# Altium project TC364_MainBoard_V1.2.PrjPcb
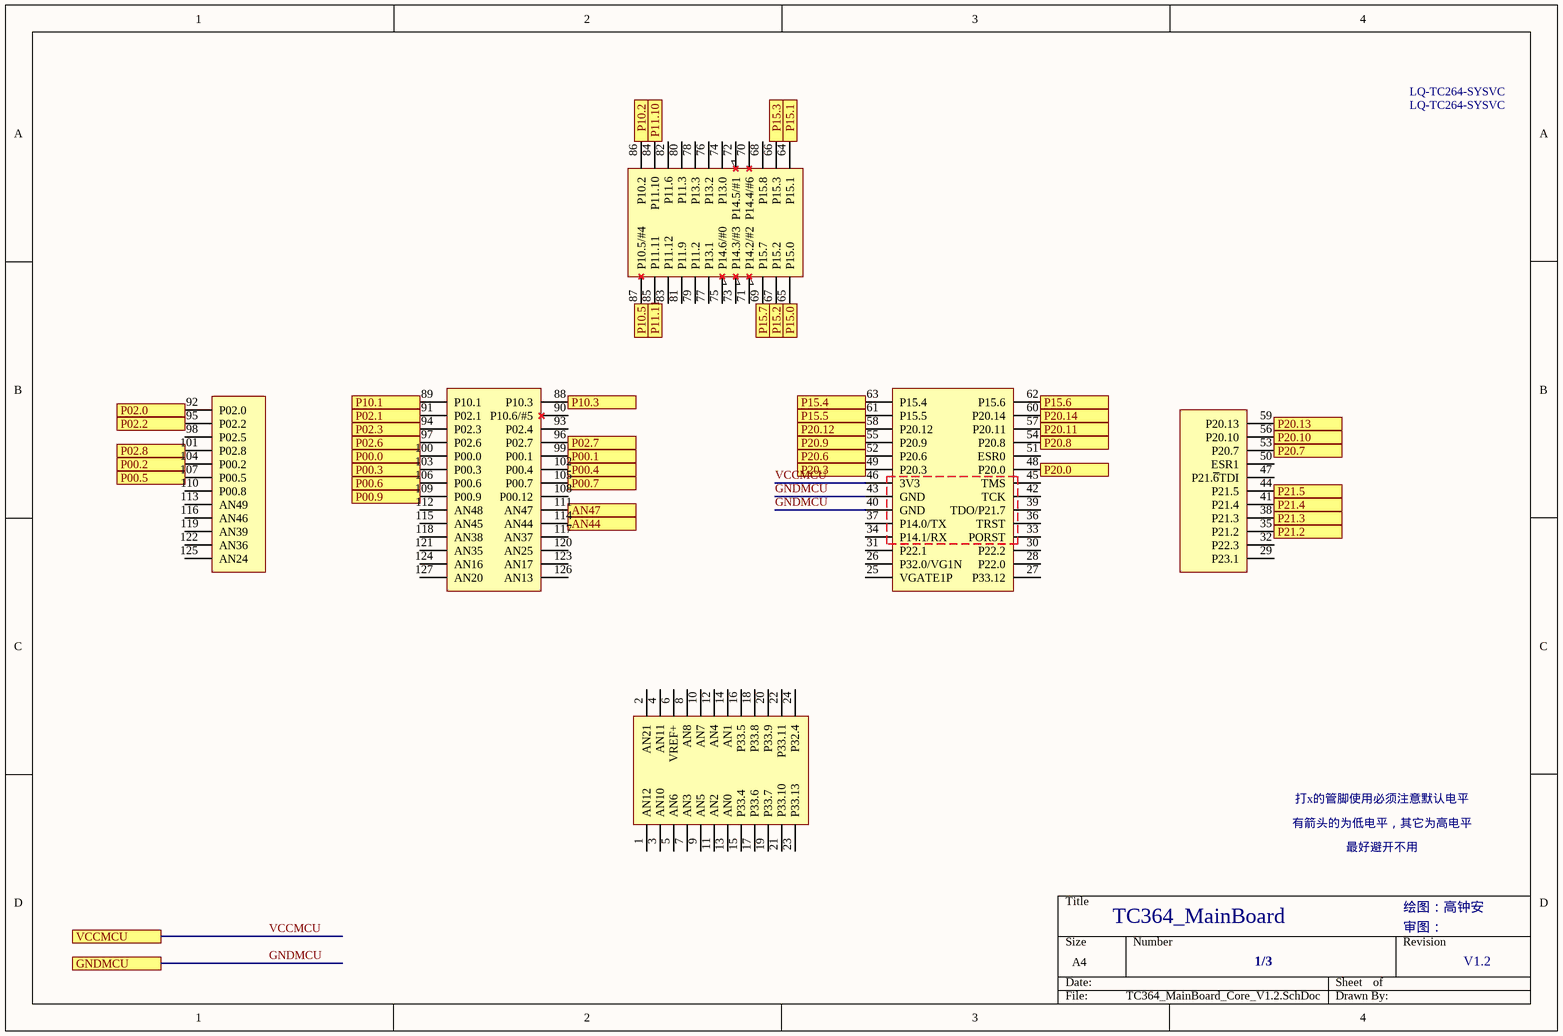
[diagram p0: TC364_MainBoard_Core_V1.2.SchDoc]
3 sheets, 72 parts. Net scope: flat (ports and power ports of the same name join across sheets).
Board file: (Poly)TC364_MainBoard_PCB_V1.2.PcbDoc
Sheets:
  TC364_MainBoard_Core_V1.2.SchDoc
  TC364_MainBoard_Power_V1.2.SchDoc
  TC364_MainBoard_Singal_V1.2.SchDoc

## Sheet TC364_MainBoard_Core_V1.2.SchDoc
size A4

### Parts
LQ-TC264-SYSVC  LQ-TC264-SYSVC  [TC364V1.2]

### Ports
AN44, AN47, GNDMCU, P00.0, P00.1, P00.2, P00.3, P00.4, P00.5, P00.6, P00.7, P00.9, P02.0, P02.1, P02.2, P02.3, P02.6, P02.7, P02.8, P10.1, P10.2, P10.3, P10.5, P11.10, P11.11, P15.0, P15.1, P15.2, P15.3, P15.4, P15.5, P15.6, P15.7, P20.0, P20.3, P20.6, P20.7, P20.8, P20.9, P20.10, P20.11, P20.12, P20.13, P20.14, P21.2, P21.3, P21.4, P21.5, VCCMCU

### Nets
GNDMCU: LQ-TC264-SYSVC.40(GND) LQ-TC264-SYSVC.43(GND) ; port GNDMCU
VCCMCU: LQ-TC264-SYSVC.46(3V3) ; port VCCMCU
AN44: LQ-TC264-SYSVC.114(AN44) ; port AN44
AN47: LQ-TC264-SYSVC.111(AN47) ; port AN47
P00.0: LQ-TC264-SYSVC.100(P00.0) ; port P00.0
P00.1: LQ-TC264-SYSVC.99(P00.1) ; port P00.1
P00.2: LQ-TC264-SYSVC.104(P00.2) ; port P00.2
P00.3: LQ-TC264-SYSVC.103(P00.3) ; port P00.3
P00.4: LQ-TC264-SYSVC.102(P00.4) ; port P00.4
P00.5: LQ-TC264-SYSVC.107(P00.5) ; port P00.5
P00.6: LQ-TC264-SYSVC.106(P00.6) ; port P00.6
P00.7: LQ-TC264-SYSVC.105(P00.7) ; port P00.7
P00.9: LQ-TC264-SYSVC.109(P00.9) ; port P00.9
P02.0: LQ-TC264-SYSVC.92(P02.0) ; port P02.0
P02.1: LQ-TC264-SYSVC.91(P02.1) ; port P02.1
P02.2: LQ-TC264-SYSVC.95(P02.2) ; port P02.2
P02.3: LQ-TC264-SYSVC.94(P02.3) ; port P02.3
P02.6: LQ-TC264-SYSVC.97(P02.6) ; port P02.6
P02.7: LQ-TC264-SYSVC.96(P02.7) ; port P02.7
P02.8: LQ-TC264-SYSVC.101(P02.8) ; port P02.8
P10.1: LQ-TC264-SYSVC.89(P10.1) ; port P10.1
P10.2: LQ-TC264-SYSVC.86(P10.2) ; port P10.2
P10.3: LQ-TC264-SYSVC.88(P10.3) ; port P10.3
P10.5: LQ-TC264-SYSVC.87(P10.5/#4) ; port P10.5
P11.10: LQ-TC264-SYSVC.84(P11.10) ; port P11.10
P11.11: LQ-TC264-SYSVC.85(P11.11) ; port P11.11
P15.0: LQ-TC264-SYSVC.65(P15.0) ; port P15.0
P15.1: LQ-TC264-SYSVC.64(P15.1) ; port P15.1
P15.2: LQ-TC264-SYSVC.67(P15.2) ; port P15.2
P15.3: LQ-TC264-SYSVC.66(P15.3) ; port P15.3
P15.4: LQ-TC264-SYSVC.63(P15.4) ; port P15.4
P15.5: LQ-TC264-SYSVC.61(P15.5) ; port P15.5
P15.6: LQ-TC264-SYSVC.62(P15.6) ; port P15.6
P15.7: LQ-TC264-SYSVC.69(P15.7) ; port P15.7
P20.0: LQ-TC264-SYSVC.48(P20.0) ; port P20.0
P20.6: LQ-TC264-SYSVC.52(P20.6) ; port P20.6
P20.7: LQ-TC264-SYSVC.53(P20.7) ; port P20.7
P20.8: LQ-TC264-SYSVC.54(P20.8) ; port P20.8
P20.9: LQ-TC264-SYSVC.55(P20.9) ; port P20.9
P20.10: LQ-TC264-SYSVC.56(P20.10) ; port P20.10
P20.11: LQ-TC264-SYSVC.57(P20.11) ; port P20.11
P20.12: LQ-TC264-SYSVC.58(P20.12) ; port P20.12
P20.13: LQ-TC264-SYSVC.59(P20.13) ; port P20.13
P20.14: LQ-TC264-SYSVC.60(P20.14) ; port P20.14
P21.2: LQ-TC264-SYSVC.35(P21.2) ; port P21.2
P21.3: LQ-TC264-SYSVC.38(P21.3) ; port P21.3
P21.4: LQ-TC264-SYSVC.41(P21.4) ; port P21.4
P21.5: LQ-TC264-SYSVC.44(P21.5) ; port P21.5
NetJP_Code1_3: LQ-TC264-SYSVC.49(P20.3) ; port P20.3

Not connected (* = marked no-connect by the designer): LQ-TC264-SYSVC 1(AN12) 2(AN21) 3(AN10) 4(AN11) 5(AN6) 6(VREF+) 7(AN3) 8(AN8) 9(AN5) 10(AN7) 11(AN2) 12(AN4) 13(AN0) 14(AN1) 15(P33.4) 16(P33.5) 17(P33.6) 18(P33.8) 19(P33.7) 20(P33.9) 21(P33.10) 22(P33.11) 23(P33.13) 24(P32.4) 25(VGATE1P) 26(P32.0/VG1N) 27(P33.12) 28(P22.0) 29(P23.1) 30(P22.2) 31(P22.1) 32(P22.3) 33(PORST) 34(P14.1/RX) 36(TRST) 37(P14.0/TX) 39(TDO/P21.7) 42(TCK) 45(TMS) 47(P21.~{6}TDI) 50(ESR1) 51(ESR0) 68(P15.8) 70(P14.4/#6) 71(P14.2/#2) 72(P14.5/#1) 73(P14.3/#3) 74(P13.0) 75(P14.6/#0) 76(P13.2) 77(P13.1) 78(P13.3) 79(P11.2) 80(P11.3) 81(P11.9) 82(P11.6) 83(P11.12) 90(P10.6/#5) 93(P02.4) 98(P02.5) 108(P00.12) 110(P00.8) 112(AN48) 113(AN49) 115(AN45) 116(AN46) 117(AN37) 118(AN38) 119(AN39) 120(AN25) 121(AN35) 122(AN36) 123(AN17) 124(AN16) 125(AN24) 126(AN13) 127(AN20)

### Notes on the sheet
- TC364_MainBoard
- 绘图：高钟安
- 1/3
- 审图：
- V1.2
- (in symbol LQ-TC264-SYSVC) 打x的管脚使用必须注意默认电平; 有箭头的为低电平，其它为高电平; 最好避开不用

## Sheet TC364_MainBoard_Power_V1.2.SchDoc
size A4
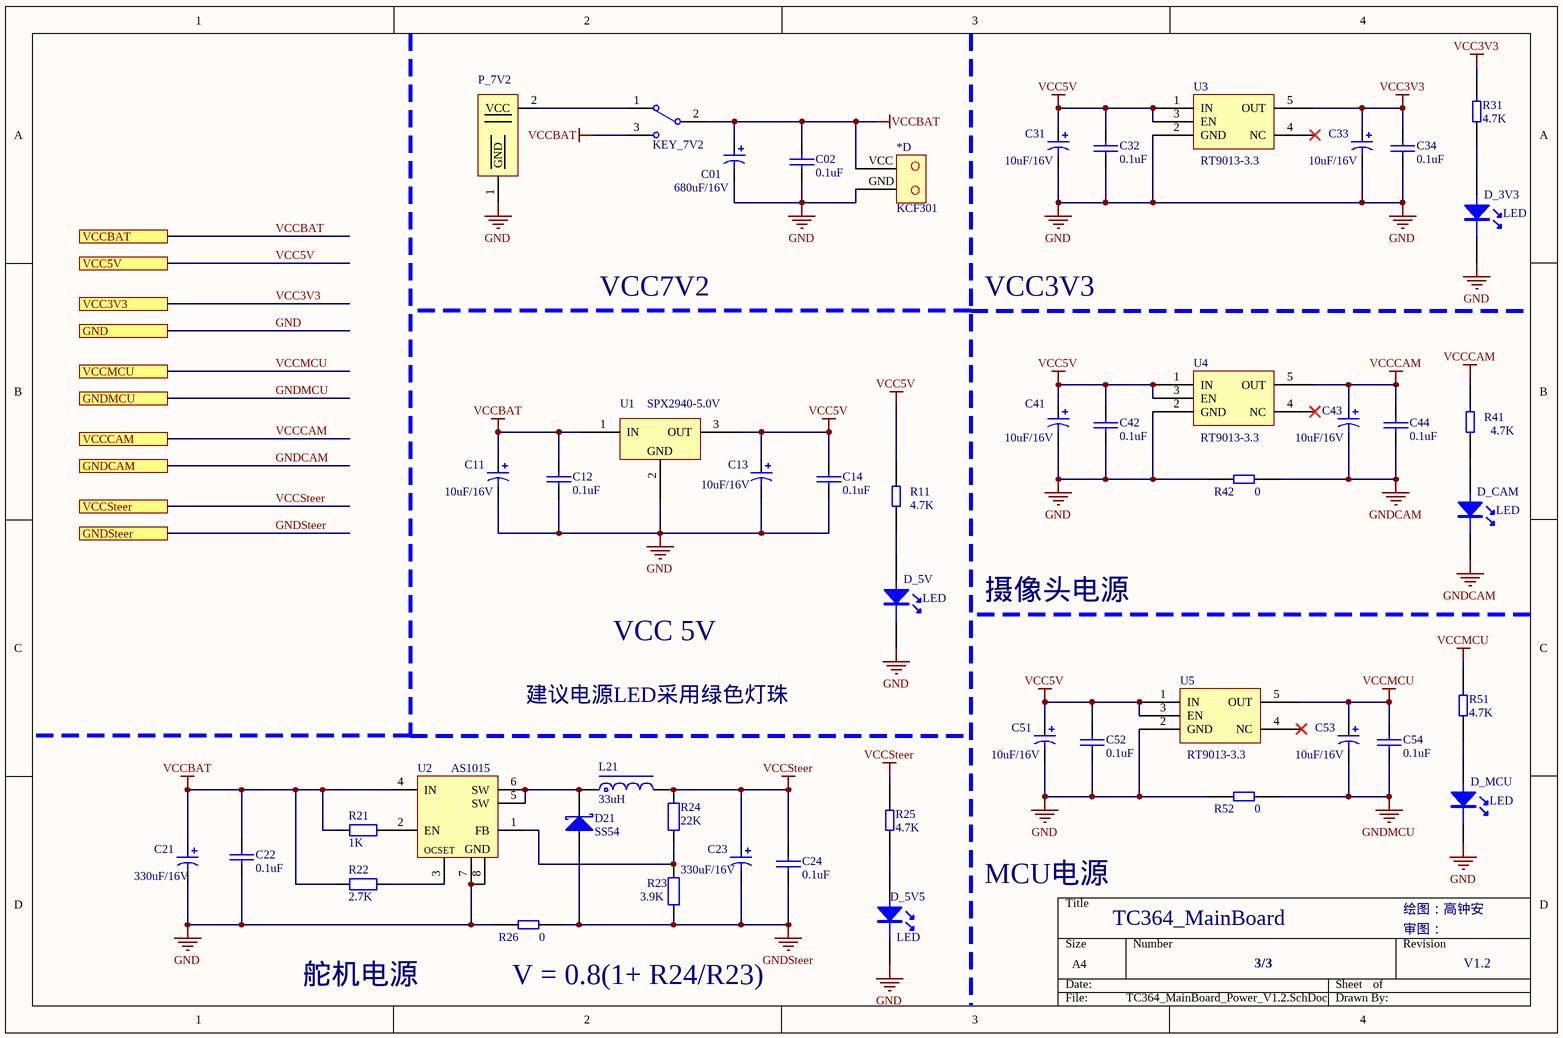
[diagram p1: TC364_MainBoard_Power_V1.2.SchDoc]

### Parts
*  KCF301  [KF301-2P]  (part D of 4)
C01  680uF/16V  [CAP 3.5*8*11.5 - GD]
C02  0.1uF  [0805C]
C11  10uF/16V  [CASE-A_3216]
C12  0.1uF  [0805C]
C13  10uF/16V  [CASE-A_3216]
C14  0.1uF  [0805C]
C21  330uF/16V  [CAP 2.5*6.3*11.2 - BK]
C22  0.1uF  [0805C]
C23  330uF/16V  [CAP 2.5*6.3*11.2 - BK]
C24  0.1uF  [0805C]
C31  10uF/16V  [CASE-A_3216]
C32  0.1uF  [0805C]
C33  10uF/16V  [CASE-A_3216]
C34  0.1uF  [0805C]
C41  10uF/16V  [CASE-A_3216]
C42  0.1uF  [0805C]
C43  10uF/16V  [CASE-A_3216]
C44  0.1uF  [0805C]
C51  10uF/16V  [CASE-A_3216]
C52  0.1uF  [0805C]
C53  10uF/16V  [CASE-A_3216]
C54  0.1uF  [0805C]
D21  SS54  [SMA]
D_3V3  LED  [0805_LED_S1]
D_5V  LED  [0805_LED_S1]
D_5V5  LED  [0805_LED_S1]
D_CAM  LED  [0805_LED_S1]
D_MCU  LED  [0805_LED_S1]
KEY_7V2  SS-12F23  [KEY_7V2]  (value not drawn)
L21  33uH  [7*7 L]
P_7V2  T_Type_Adapter  [T_Type_Adapter]  (value not drawn)
R11  4.7K  [0805R]
R21  1K  [0805R]
R22  2.7K  [0805R]
R23  3.9K  [0805R]
R24  22K  [0805R]
R25  4.7K  [0805R]
R26  0  [0805R]
R31  4.7K  [0805R]
R41  4.7K  [0805R]
R42  0  [0805R]
R51  4.7K  [0805R]
R52  0  [0805R]
U1  SPX2940-5.0V  [TO-220(TO-220-3)]
U2  AS1015  [SOP-8_150mil]
U3  RT9013-3.3  [SOT-23-5]
U4  RT9013-3.3  [SOT-23-5]
U5  RT9013-3.3  [SOT-23-5]

### Ports
GND, GNDCAM, GNDMCU, GNDSteer, VCC3V3, VCC5V, VCCBAT, VCCCAM, VCCMCU, VCCSteer

### Nets
GND: C01.2 C02.2 C11.2 C12.2 C13.2 C14.2 C21.2 C22.2 C31.2 C32.2 C33.2 C34.2 C41.2 C42.2 C51.2 C52.2 D_3V3.K D_5V.K D_5V5.K P_7V2.1(GND) R26.2 R42.2 R52.2 U1.2(GND) U2.7(GND) U2.8(GND) U3.2(GND) U4.2(GND) U5.2(GND) ; port GND
GNDCAM: C43.2 C44.2 D_CAM.K R42.1 ; port GNDCAM
GNDMCU: C53.2 C54.2 R52.1 ; port GNDMCU
GNDSteer: C23.2 C24.2 D21.1(A) R23.2 R26.1 ; port GNDSteer
VCC3V3: C33.1 C34.1 R31.1 U3.5(OUT) ; port VCC3V3
VCC5V: C13.1 C14.1 C31.1 C32.1 C41.1 C42.1 C51.1 C52.1 R11.1 U1.3(OUT) U3.1(IN) U3.3(EN) U4.1(IN) U4.3(EN) U5.1(IN) U5.3(EN) ; port VCC5V
VCCBAT: C01.1 C02.1 C11.1 C12.1 C21.1 C22.1 KEY_7V2.2 KEY_7V2.3 R21.2 R22.2 U1.1(IN) U2.4(IN) ; port VCCBAT
VCCCAM: C43.1 C44.1 R41.1 U4.5(OUT) ; port VCCCAM
VCCMCU: C53.1 C54.1 R51.1 U5.5(OUT) ; port VCCMCU
VCCSteer: C23.1 C24.1 L21.2 R24.1 R25.1 ; port VCCSteer
NetD21_2: D21.2(K) L21.1 U2.5(SW) U2.6(SW)
NetD_3V3_A: D_3V3.A R31.2
NetD_5V5_A: D_5V5.A R25.2
NetD_5V_A: D_5V.A R11.2
NetD_CAM_A: D_CAM.A R41.2
NetD_MCU_A: D_MCU.A R51.2
NetKEY_7V2_1: KEY_7V2.1 P_7V2.2(VCC)
NetR21_1: R21.1 U2.2(EN)
NetR22_1: R22.1 U2.3(OCSET)
NetR23_1: R23.1 R24.2 U2.1(FB)

Not connected (* = marked no-connect by the designer): * GND(1) VCC(0); D_MCU K(2); U3 4(NC)*; U4 4(NC)*; U5 4(NC)*

### Notes on the sheet
- VCC7V2
- VCC3V3
- VCC 5V
- 摄像头电源
- 建议电源LED采用绿色灯珠
- MCU电源
- TC364_MainBoard
- 绘图：高钟安
- 舵机电源
- V = 0.8(1+ R24/R23)
- 3/3
- 审图：
- V1.2
- Labels drawn without touching a wire or pin: GND

### Library data of the parts
C01 C11 C13 C21 C23 C31 C33 C41 C43 C51 C53 = Cap Pol1: Polarized Capacitor (Radial); Published: 8-Jun-2000; LatestRevisionDate: 17-Jul-2002; LatestRevisionNote: Re-released for DXP Platform.; PackageReference: RB7.6-15; Publisher: Altium Limited; PackageDescription: Polarized Capacitor (Radial); 2 Leads
C02 C12 C14 C22 C24 C32 C34 C42 C44 C52 C54 = CAP: Capacitor
D21 = SS34: 肖特基二极管; 属性: 40V/3A; BOM名称: 肖特基二极管; 封装库来自淘宝 ID：黄晶宝石: https://shop463601444.taobao.com
D_3V3 D_5V D_5V5 D_CAM D_MCU = LED: 发光二极管
KEY_7V2 = SSW-1P: 1路波动开关; BOM名称: 波动开关; 版权归属: 封装库来自淘宝 ID：黄晶宝石; 学习资源: www.ooocke.com
L21 = L-CDRH: 功率屏蔽电感; 版权归属: 封装库来自淘宝 ID：黄晶宝石; BOM名称: 功率屏蔽电感; 联系售后: https://shop463601444.taobao.com
R11 R25 R26 R31 R41 R42 R51 R52 = RES
R21-R24 = RES: 贴片电阻; 版权归属: 源创客; BOM名称: 贴片电阻; 学习资源: www.ooocke.com
U1 = LM2940: 5V稳压芯片; 版权归属: 封装库来自淘宝 ID：黄晶宝石; BOM名称: 5V稳压芯片; 联系售后: www.ooocke.com
U2 = AS1015: 可调升压芯片

## Sheet TC364_MainBoard_Singal_V1.2.SchDoc
size A4
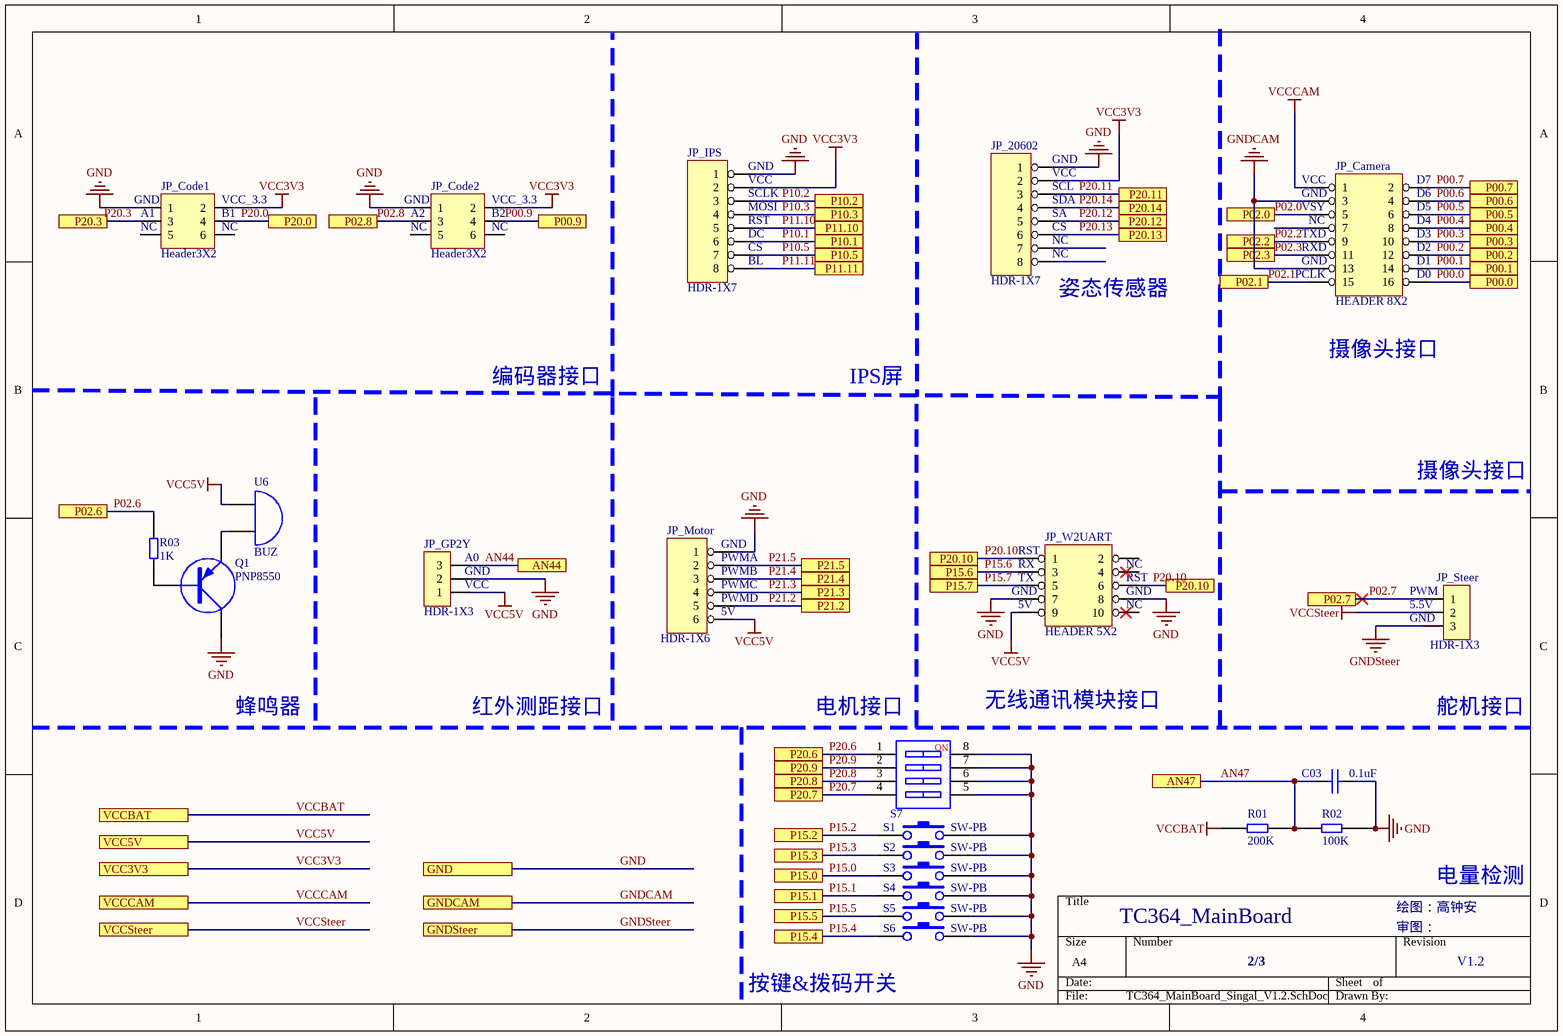
[diagram p2: TC364_MainBoard_Singal_V1.2.SchDoc]

### Parts
C03  0.1uF  [0805C]
JP_20602  HDR-1X7  [SIP8]
JP_Camera  HEADER 8X2  [IDC16-JLC - duplicate]
JP_Code1  Header3X2  [HDR2.54-LI-2x3P]
JP_Code2  Header3X2  [HDR2.54-LI-2x3P]
JP_GP2Y  HDR-1X3  [SIP3N]
JP_IPS  HDR-1X7  [SIP8]
JP_Motor  HDR-1X6  [SIP6N]
JP_Steer  HDR-1X3  [HDR2.54-LI-3P]
JP_W2UART  HEADER 5X2  [IDC10-JLC]
Q1  PNP8550  [PNP8550-SO]
R01  200K  [0805R]
R02  100K  [0805R]
R03  1K  [0805R]
S1  SW-PB  [KEY2-6X3]
S2  SW-PB  [KEY2-6X3]
S3  SW-PB  [KEY2-6X3]
S4  SW-PB  [KEY2-6X3]
S5  SW-PB  [KEY2-6X3]
S6  SW-PB  [KEY2-6X3]
S7  SW-4P  [CSW DIP-4P]  (value not drawn)
U6  BUZ  [BUZ]

### Ports
AN44, AN47, GND, GNDCAM, GNDSteer, P00.0, P00.1, P00.2, P00.3, P00.4, P00.5, P00.6, P00.7, P00.9, P02.0, P02.1, P02.2, P02.3, P02.6, P02.7, P02.8, P10.1, P10.2, P10.3, P10.5, P11.10, P11.11, P15.0, P15.1, P15.2, P15.3, P15.4, P15.5, P15.6, P15.7, P20.0, P20.3, P20.6, P20.7, P20.8, P20.9, P20.10, P20.11, P20.12, P20.13, P20.14, P21.2, P21.3, P21.4, P21.5, VCC3V3, VCC5V, VCCBAT, VCCCAM, VCCSteer

### Nets
GND: C03.2 JP_20602.1 JP_Code1.1 JP_Code2.1 JP_GP2Y.2 JP_IPS.1 JP_Motor.1 JP_W2UART.7 JP_W2UART.8 Q1.3(C) R02.1 S1.2 S2.2 S3.2 S4.2 S5.2 S6.2 S7.5 S7.6 S7.7 S7.8 ; port GND
GNDCAM: JP_Camera.3 JP_Camera.13 ; port GNDCAM
GNDSteer: JP_Steer.3 ; port GNDSteer
VCC3V3: JP_20602.2 JP_Code1.2 JP_Code2.2 JP_IPS.2 ; port VCC3V3
VCC5V: JP_GP2Y.1 JP_Motor.6 JP_W2UART.9 U6.1(A) ; port VCC5V
VCCBAT: R01.2 ; port VCCBAT
VCCCAM: JP_Camera.1 ; port VCCCAM
VCCSteer: JP_Steer.2 ; port VCCSteer
AN44: JP_GP2Y.3 ; port AN44
AN47: C03.1 R01.1 R02.2 ; port AN47
P00.0: JP_Camera.16 ; port P00.0
P00.1: JP_Camera.14 ; port P00.1
P00.2: JP_Camera.12 ; port P00.2
P00.3: JP_Camera.10 ; port P00.3
P00.4: JP_Camera.8 ; port P00.4
P00.5: JP_Camera.6 ; port P00.5
P00.6: JP_Camera.4 ; port P00.6
P00.7: JP_Camera.2 ; port P00.7
P00.9: JP_Code2.4 ; port P00.9
P02.0: JP_Camera.5 ; port P02.0
P02.1: JP_Camera.15 ; port P02.1
P02.2: JP_Camera.9 ; port P02.2
P02.3: JP_Camera.11 ; port P02.3
P02.6: R03.1 ; port P02.6
P02.7: JP_Steer.1 ; port P02.7
P02.8: JP_Code2.3 ; port P02.8
P10.1: JP_IPS.6 ; port P10.1
P10.2: JP_IPS.3 ; port P10.2
P10.3: JP_IPS.4 ; port P10.3
P10.5: JP_IPS.7 ; port P10.5
P11.10: JP_IPS.5 ; port P11.10
P11.11: JP_IPS.8 ; port P11.11
P15.0: S3.1 ; port P15.0
P15.1: S4.1 ; port P15.1
P15.2: S1.1 ; port P15.2
P15.3: S2.1 ; port P15.3
P15.4: S6.1 ; port P15.4
P15.5: S5.1 ; port P15.5
P15.6: JP_W2UART.3 ; port P15.6
P15.7: JP_W2UART.5 ; port P15.7
P20.0: JP_Code1.4 ; port P20.0
P20.6: S7.1 ; port P20.6
P20.7: S7.4 ; port P20.7
P20.8: S7.3 ; port P20.8
P20.9: S7.2 ; port P20.9
P20.10: JP_W2UART.1 JP_W2UART.6 ; port P20.10
P20.11: JP_20602.3 ; port P20.11
P20.12: JP_20602.5 ; port P20.12
P20.13: JP_20602.6 ; port P20.13
P20.14: JP_20602.4 ; port P20.14
P21.2: JP_Motor.5 ; port P21.2
P21.3: JP_Motor.4 ; port P21.3
P21.4: JP_Motor.3 ; port P21.4
P21.5: JP_Motor.2 ; port P21.5
NetJP_Code1_3: JP_Code1.3 ; port P20.3
NetQ1_1: Q1.1(B) R03.2
NetQ1_2: Q1.2(E) U6.2(B)

Not connected (* = marked no-connect by the designer): JP_20602 7 8; JP_Camera 7; JP_Code1 5 6; JP_Code2 5 6; JP_W2UART 2 4 10

### Notes on the sheet
- (near JP_IPS) GND
- (near JP_20602) VCC
- (near JP_20602) GND
- (near JP_Code1) GND
- (near JP_Code1) A1
- (near JP_Code1) NC
- (near JP_Code1) B1
- (near JP_Code1) VCC_3.3
- (near JP_Code2) GND
- (near JP_Code2) A2
- (near JP_Code2) NC
- (near JP_Code2) B2
- (near JP_Code2) VCC_3.3
- (near JP_IPS) VCC
- (near JP_IPS) SCLK
- (near JP_IPS) MOSI
- (near JP_IPS) RST
- (near JP_IPS) DC
- (near JP_IPS) CS
- (near JP_20602) SCL
- (near JP_20602) SDA
- (near JP_20602) SA
- (near JP_20602) NC
- (near JP_20602) CS
- (near JP_Camera) GND
- (near JP_Camera) TXD
- (near JP_Camera) RXD
- (near JP_Camera) VSY
- (near JP_Camera) VCC
- (near JP_Camera) NC
- (near JP_Camera) D2
- (near JP_Camera) D3
- (near JP_Camera) D4
- (near JP_Camera) D5
- (near JP_Camera) D6
- (near JP_Camera) D7
- (near JP_IPS) BL
- (near JP_20602) 姿态传感器
- (near JP_Camera) PCLK
- (near JP_Camera) D0
- (near JP_Camera) D1
- 编码器接口
- IPS屏
- 摄像头接口
- (near JP_GP2Y) A0
- (near JP_GP2Y) GND
- (near JP_Motor) GND
- (near JP_Motor) PWMA
- (near JP_Motor) PWMB
- (near JP_W2UART) TX
- (near JP_W2UART) RX
- (near JP_W2UART) RST
- (near JP_W2UART) NC
- (near JP_GP2Y) VCC
- (near JP_Motor) 5V
- (near JP_Motor) PWMC
- (near JP_Motor) PWMD
- (near JP_W2UART) GND
- (near JP_W2UART) 5V
- (near JP_Steer) PWM
- (near JP_Steer) GND
- (near JP_Steer) 5.5V
- 蜂鸣器
- 红外测距接口
- (near S7) 电机接口
- 无线通讯模块接口
- 舵机接口
- TC364_MainBoard
- 绘图：高钟安
- 电量检测
- 2/3
- 审图：
- V1.2
- 按键&拨码开关
- Labels drawn without touching a wire or pin: P20.3
- (in symbol SW-4P) NO

### Library data of the parts
C03 = CAP: Capacitor
JP_20602 JP_IPS = HEADER 8: 8 Pin Header
JP_Code1 JP_Code2 = Header 3X2: 3*2P接插件; 版权归属: 封装库来自淘宝 ID：黄晶宝石; BOM名称: 3*2P接插件; 学习资源: https://shop463601444.taobao.com
JP_GP2Y JP_Steer = Header 3: 3P接插件; 版权归属: 封装库来自淘宝 ID：黄晶宝石; BOM名称: 3P接插件; 学习资源: https://shop463601444.taobao.com
JP_Motor = HEADER 6
Q1 = PNP: PNP Transistor
R01 R02 R03 = RES
S1-S6 = SW-PB: 按键
S7 = SW-4P: 4路编码开关; 淘宝ID: 封装库来自淘宝 ID：黄晶宝石; BOM名称: 4路编码开关; 学习资源: https://shop463601444.taobao.com
U6 = BELL

## Nets that join several sheets
GND: TC364_MainBoard_Power_V1.2 (29 pins), TC364_MainBoard_Singal_V1.2 (21 pins)
GNDCAM: TC364_MainBoard_Power_V1.2 (C43.2 C44.2 D_CAM.K R42.1), TC364_MainBoard_Singal_V1.2 (JP_Camera.3 JP_Camera.13)
GNDMCU: TC364_MainBoard_Core_V1.2 (LQ-TC264-SYSVC.40 LQ-TC264-SYSVC.43), TC364_MainBoard_Power_V1.2 (C53.2 C54.2 R52.1)
GNDSteer: TC364_MainBoard_Power_V1.2 (5 pins), TC364_MainBoard_Singal_V1.2 (JP_Steer.3)
VCC3V3: TC364_MainBoard_Power_V1.2 (C33.1 C34.1 R31.1 U3.5), TC364_MainBoard_Singal_V1.2 (JP_20602.2 JP_Code1.2 JP_Code2.2 JP_IPS.2)
VCC5V: TC364_MainBoard_Power_V1.2 (16 pins), TC364_MainBoard_Singal_V1.2 (JP_GP2Y.1 JP_Motor.6 JP_W2UART.9 U6.1)
VCCBAT: TC364_MainBoard_Power_V1.2 (12 pins), TC364_MainBoard_Singal_V1.2 (R01.2)
VCCCAM: TC364_MainBoard_Power_V1.2 (C43.1 C44.1 R41.1 U4.5), TC364_MainBoard_Singal_V1.2 (JP_Camera.1)
VCCMCU: TC364_MainBoard_Core_V1.2 (LQ-TC264-SYSVC.46), TC364_MainBoard_Power_V1.2 (C53.1 C54.1 R51.1 U5.5)
VCCSteer: TC364_MainBoard_Power_V1.2 (5 pins), TC364_MainBoard_Singal_V1.2 (JP_Steer.2)
AN44: TC364_MainBoard_Core_V1.2 (LQ-TC264-SYSVC.114), TC364_MainBoard_Singal_V1.2 (JP_GP2Y.3)
AN47: TC364_MainBoard_Core_V1.2 (LQ-TC264-SYSVC.111), TC364_MainBoard_Singal_V1.2 (C03.1 R01.1 R02.2)
NetJP_Code1_3: TC364_MainBoard_Core_V1.2 (LQ-TC264-SYSVC.49), TC364_MainBoard_Singal_V1.2 (JP_Code1.3)
P00.0: TC364_MainBoard_Core_V1.2 (LQ-TC264-SYSVC.100), TC364_MainBoard_Singal_V1.2 (JP_Camera.16)
P00.1: TC364_MainBoard_Core_V1.2 (LQ-TC264-SYSVC.99), TC364_MainBoard_Singal_V1.2 (JP_Camera.14)
P00.2: TC364_MainBoard_Core_V1.2 (LQ-TC264-SYSVC.104), TC364_MainBoard_Singal_V1.2 (JP_Camera.12)
P00.3: TC364_MainBoard_Core_V1.2 (LQ-TC264-SYSVC.103), TC364_MainBoard_Singal_V1.2 (JP_Camera.10)
P00.4: TC364_MainBoard_Core_V1.2 (LQ-TC264-SYSVC.102), TC364_MainBoard_Singal_V1.2 (JP_Camera.8)
P00.5: TC364_MainBoard_Core_V1.2 (LQ-TC264-SYSVC.107), TC364_MainBoard_Singal_V1.2 (JP_Camera.6)
P00.6: TC364_MainBoard_Core_V1.2 (LQ-TC264-SYSVC.106), TC364_MainBoard_Singal_V1.2 (JP_Camera.4)
P00.7: TC364_MainBoard_Core_V1.2 (LQ-TC264-SYSVC.105), TC364_MainBoard_Singal_V1.2 (JP_Camera.2)
P00.9: TC364_MainBoard_Core_V1.2 (LQ-TC264-SYSVC.109), TC364_MainBoard_Singal_V1.2 (JP_Code2.4)
P02.0: TC364_MainBoard_Core_V1.2 (LQ-TC264-SYSVC.92), TC364_MainBoard_Singal_V1.2 (JP_Camera.5)
P02.1: TC364_MainBoard_Core_V1.2 (LQ-TC264-SYSVC.91), TC364_MainBoard_Singal_V1.2 (JP_Camera.15)
P02.2: TC364_MainBoard_Core_V1.2 (LQ-TC264-SYSVC.95), TC364_MainBoard_Singal_V1.2 (JP_Camera.9)
P02.3: TC364_MainBoard_Core_V1.2 (LQ-TC264-SYSVC.94), TC364_MainBoard_Singal_V1.2 (JP_Camera.11)
P02.6: TC364_MainBoard_Core_V1.2 (LQ-TC264-SYSVC.97), TC364_MainBoard_Singal_V1.2 (R03.1)
P02.7: TC364_MainBoard_Core_V1.2 (LQ-TC264-SYSVC.96), TC364_MainBoard_Singal_V1.2 (JP_Steer.1)
P02.8: TC364_MainBoard_Core_V1.2 (LQ-TC264-SYSVC.101), TC364_MainBoard_Singal_V1.2 (JP_Code2.3)
P10.1: TC364_MainBoard_Core_V1.2 (LQ-TC264-SYSVC.89), TC364_MainBoard_Singal_V1.2 (JP_IPS.6)
P10.2: TC364_MainBoard_Core_V1.2 (LQ-TC264-SYSVC.86), TC364_MainBoard_Singal_V1.2 (JP_IPS.3)
P10.3: TC364_MainBoard_Core_V1.2 (LQ-TC264-SYSVC.88), TC364_MainBoard_Singal_V1.2 (JP_IPS.4)
P10.5: TC364_MainBoard_Core_V1.2 (LQ-TC264-SYSVC.87), TC364_MainBoard_Singal_V1.2 (JP_IPS.7)
P11.10: TC364_MainBoard_Core_V1.2 (LQ-TC264-SYSVC.84), TC364_MainBoard_Singal_V1.2 (JP_IPS.5)
P11.11: TC364_MainBoard_Core_V1.2 (LQ-TC264-SYSVC.85), TC364_MainBoard_Singal_V1.2 (JP_IPS.8)
P15.0: TC364_MainBoard_Core_V1.2 (LQ-TC264-SYSVC.65), TC364_MainBoard_Singal_V1.2 (S3.1)
P15.1: TC364_MainBoard_Core_V1.2 (LQ-TC264-SYSVC.64), TC364_MainBoard_Singal_V1.2 (S4.1)
P15.2: TC364_MainBoard_Core_V1.2 (LQ-TC264-SYSVC.67), TC364_MainBoard_Singal_V1.2 (S1.1)
P15.3: TC364_MainBoard_Core_V1.2 (LQ-TC264-SYSVC.66), TC364_MainBoard_Singal_V1.2 (S2.1)
P15.4: TC364_MainBoard_Core_V1.2 (LQ-TC264-SYSVC.63), TC364_MainBoard_Singal_V1.2 (S6.1)
P15.5: TC364_MainBoard_Core_V1.2 (LQ-TC264-SYSVC.61), TC364_MainBoard_Singal_V1.2 (S5.1)
P15.6: TC364_MainBoard_Core_V1.2 (LQ-TC264-SYSVC.62), TC364_MainBoard_Singal_V1.2 (JP_W2UART.3)
P15.7: TC364_MainBoard_Core_V1.2 (LQ-TC264-SYSVC.69), TC364_MainBoard_Singal_V1.2 (JP_W2UART.5)
P20.0: TC364_MainBoard_Core_V1.2 (LQ-TC264-SYSVC.48), TC364_MainBoard_Singal_V1.2 (JP_Code1.4)
P20.6: TC364_MainBoard_Core_V1.2 (LQ-TC264-SYSVC.52), TC364_MainBoard_Singal_V1.2 (S7.1)
P20.7: TC364_MainBoard_Core_V1.2 (LQ-TC264-SYSVC.53), TC364_MainBoard_Singal_V1.2 (S7.4)
P20.8: TC364_MainBoard_Core_V1.2 (LQ-TC264-SYSVC.54), TC364_MainBoard_Singal_V1.2 (S7.3)
P20.9: TC364_MainBoard_Core_V1.2 (LQ-TC264-SYSVC.55), TC364_MainBoard_Singal_V1.2 (S7.2)
P20.10: TC364_MainBoard_Core_V1.2 (LQ-TC264-SYSVC.56), TC364_MainBoard_Singal_V1.2 (JP_W2UART.1 JP_W2UART.6)
P20.11: TC364_MainBoard_Core_V1.2 (LQ-TC264-SYSVC.57), TC364_MainBoard_Singal_V1.2 (JP_20602.3)
P20.12: TC364_MainBoard_Core_V1.2 (LQ-TC264-SYSVC.58), TC364_MainBoard_Singal_V1.2 (JP_20602.5)
P20.13: TC364_MainBoard_Core_V1.2 (LQ-TC264-SYSVC.59), TC364_MainBoard_Singal_V1.2 (JP_20602.6)
P20.14: TC364_MainBoard_Core_V1.2 (LQ-TC264-SYSVC.60), TC364_MainBoard_Singal_V1.2 (JP_20602.4)
P21.2: TC364_MainBoard_Core_V1.2 (LQ-TC264-SYSVC.35), TC364_MainBoard_Singal_V1.2 (JP_Motor.5)
P21.3: TC364_MainBoard_Core_V1.2 (LQ-TC264-SYSVC.38), TC364_MainBoard_Singal_V1.2 (JP_Motor.4)
P21.4: TC364_MainBoard_Core_V1.2 (LQ-TC264-SYSVC.41), TC364_MainBoard_Singal_V1.2 (JP_Motor.3)
P21.5: TC364_MainBoard_Core_V1.2 (LQ-TC264-SYSVC.44), TC364_MainBoard_Singal_V1.2 (JP_Motor.2)